# Altium schematic sheet nRF24L01.SchDoc
size A4
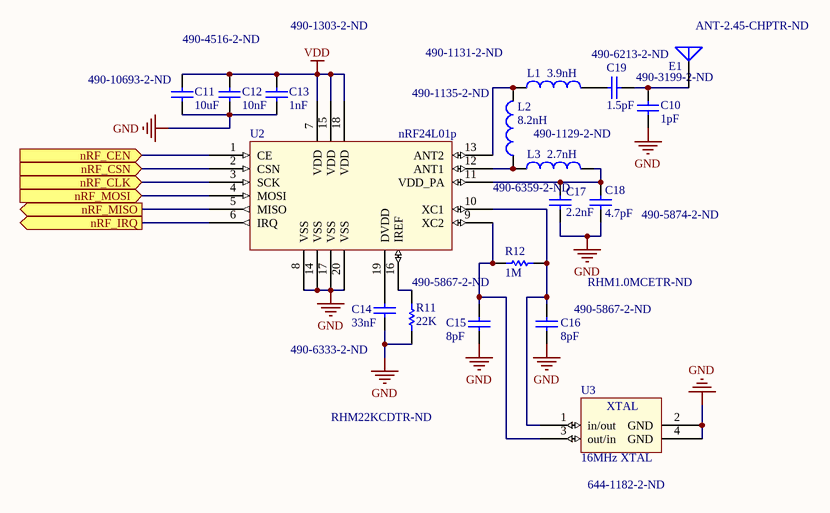
[diagram p0: nRF24L01.SchDoc]

## Parts
C10  value 1pF  Supplier Part Number 1: 490-3199-2-ND  [0402]
C11  value 10uF  Supplier Part Number 1: 490-10693-2-ND  [0402]
C12  value 10nF  Supplier Part Number 1: 490-4516-2-ND  [0402]
C13  value 1nF  Supplier Part Number 1: 490-1303-2-ND  [0402]
C14  value 33nF  Supplier Part Number 1: 490-6333-2-ND  [0402]
C15  value 8pF  Supplier Part Number 1: 490-5867-2-ND  [0402]
C16  value 8pF  Supplier Part Number 1: 490-5867-2-ND  [0402]
C17  value 2.2nF  Supplier Part Number 1: 490-6359-2-ND  [0402]
C18  value 4.7pF  Supplier Part Number 1: 490-5874-2-ND  [0402]
C19  value 1.5pF  Supplier Part Number 1: 490-6213-2-ND  [0402]
E1  Supplier Part Number 1: ANT-2.45-CHPTR-ND  [ANT-2.45-CHP-B]
L1  value 3.9nH  Supplier Part Number 1: 490-1131-2-ND  [0402]
L2  value 8.2nH  Supplier Part Number 1: 490-1135-2-ND  [0402]
L3  value 2.7nH  Supplier Part Number 1: 490-1129-2-ND  [0402]
R11  value 22K  Supplier Part Number 1: RHM22KCDTR-ND  [0402]
R12  value 1M  Supplier Part Number 1: RHM1.0MCETR-ND  [0402]
U2  nRF24L01p  [Component_nRF]
U3  16MHz XTAL  Supplier Part Number 1: 644-1182-2-ND  [8Y-16.000MAAV-T]

## Ports
nRF_CEN (in), nRF_CLK (in), nRF_CSN (in), nRF_IRQ (out), nRF_MISO (out), nRF_MOSI (in)

## Nets
GND: C10.2 C11.1 C12.1 C13.1 C14.1 C15.1 C16.1 C17.1 C18.1 R11.1 U2.8(VSS) U2.14(VSS) U2.17(VSS) U2.20(VSS) U3.2(GND) U3.4(GND)
VDD: C11.2 C12.2 C13.2 U2.7(VDD) U2.15(VDD) U2.18(VDD)
nRF_CEN: U2.1(CE) ; port nRF_CEN
nRF_CLK: U2.3(SCK) ; port nRF_CLK
nRF_CSN: U2.2(CSN) ; port nRF_CSN
nRF_IRQ: U2.6(IRQ) ; port nRF_IRQ
nRF_MISO: U2.5(MISO) ; port nRF_MISO
nRF_MOSI: U2.4(MOSI) ; port nRF_MOSI
NetC10_1: C10.1 C19.1 E1.1(A)
NetC14_2: C14.2 U2.19(DVDD)
NetC15_2: C15.2 R12.2 U2.9(XC2) U3.3(out/in)
NetC16_2: C16.2 R12.1 U2.10(XC1) U3.1(in/out)
NetC17_2: C17.2 C18.2 L3.2 U2.11(VDD_PA)
NetC19_2: C19.2 L1.2
NetL1_1: L1.1 L2.2 U2.13(ANT2)
NetL2_1: L2.1 L3.1 U2.12(ANT1)
NetR11_2: R11.2 U2.16(IREF)

## Notes on the sheet
- (in symbol 8Y-16.000MAAV-T) XTAL

## Library data of the parts
C10-C19 = Cap Semi: Capacitor (Semiconductor SIM Model); Published: 8-Jun-2000; LatestRevisionDate: 29-May-2009; LatestRevisionNote: IPC-7351 Footprint Added.; PackageReference: C1206; Publisher: Altium Limited; PackageDescription: Chip Capacitor; Supplier 1: Digi-Key
E1 = Antenna: Generic Antenna; Published: 24-Mar-1999; LatestRevisionDate: 17-Jul-2002; LatestRevisionNote: Re-released for DXP Platform.; PackageReference: PIN1; Publisher: Altium Limited; Supplier 1: Digi-Key
L1-L3 = Inductor: Code_IEC: 1005; Published: 8-Jun-2000; LatestRevisionDate: 29-May-2009; LatestRevisionNote: IPC-7351 Footprint Added.; PackageReference: 0402-A; Publisher: Altium Limited; PackageDescription: Chip Inductor; Code_JEITA: 0402; Supplier 1: Digi-Key
R11 R12 = Res Semi: Semiconductor Resistor; Published: 8-Jun-2000; LatestRevisionDate: 17-Jul-2002; LatestRevisionNote: Re-released for DXP Platform.; PackageReference: AXIAL-0.5; Publisher: Altium Limited; PackageDescription: Axial Device, Thru-Hole; 2 Leads; 0.5 in Pin Spacing; Supplier 1: Digi-Key
U2 = Component_nRF
U3 = 8Y-16.000MAAV-T: SMD 16 MHz XTAL; Supplier 1: Digi-Key